# Altium schematic sheet SCH-7-ESC5.SchDoc
size Letter
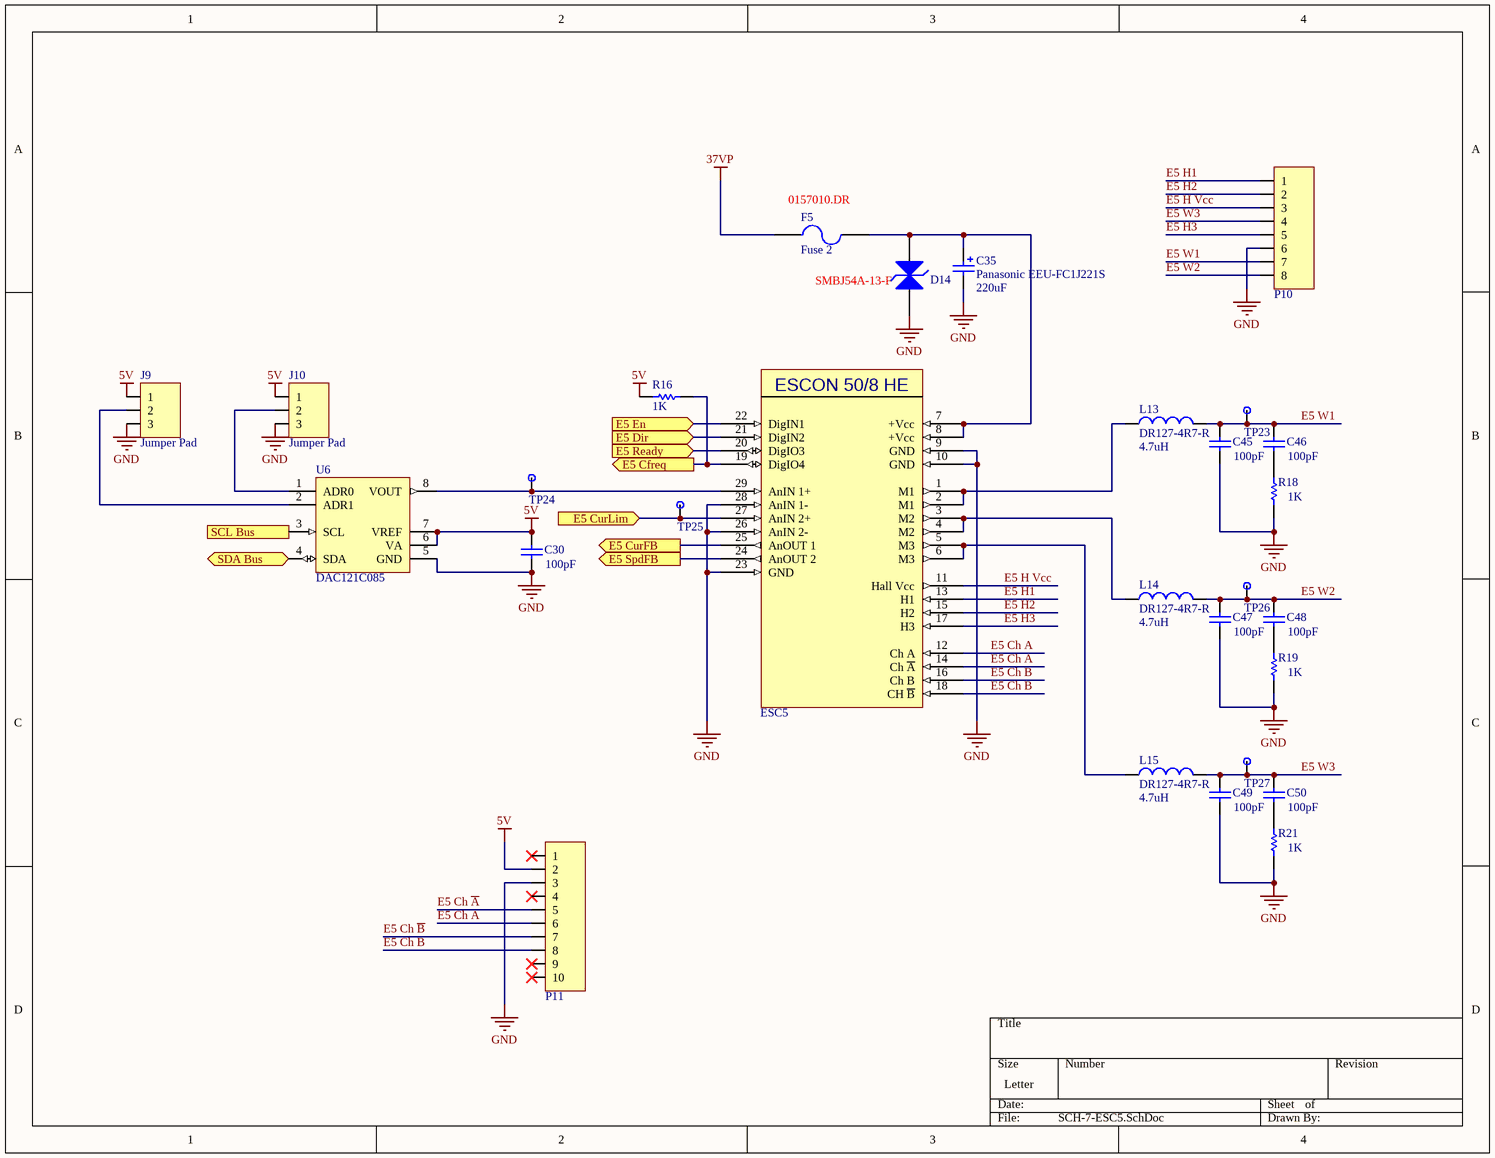
[diagram p0: SCH-7-ESC5.SchDoc]

## Parts
C30  value 100pF  [C1206]  (hidden comment: Cap Semi)
C35  Panasonic EEU-FC1J221S  value 220uF  [Panasonic EEU-FC1J221S]
C45  value 100pF  [C1206]  (hidden comment: Cap Semi)
C46  value 100pF  [C1206]  (hidden comment: Cap Semi)
C47  value 100pF  [C1206]  (hidden comment: Cap Semi)
C48  value 100pF  [C1206]  (hidden comment: Cap Semi)
C49  value 100pF  [C1206]  (hidden comment: Cap Semi)
C50  value 100pF  [C1206]  (hidden comment: Cap Semi)
D14  TVS_DIODE  [SMBJ54A-13-F]  (value not drawn)
ESC5  ESCON 50/8 HE  [ESCON 50/8 HE]  (value not drawn)
F5  Fuse 2  [0157010.DR]
J9  Jumper Pad  [3 Pad TH]
J10  Jumper Pad  [3 Pad TH]
L13  DR127-4R7-R  value 4.7uH  [DR127-4R7-R]
L14  DR127-4R7-R  value 4.7uH  [DR127-4R7-R]
L15  DR127-4R7-R  value 4.7uH  [DR127-4R7-R]
P10  Mini-Fit Jr 8 Pos  [Molex Mini-Fit Jr 0039281083]  (value not drawn)
P11  Header_10_Pos_Ribbon Male  [3M_2510-6002UB]  (value not drawn)
R16  value 1K  [RESC1608X06N_0603]  (hidden comment: Res1)
R18  value 1K  [RESC1608X06N_0603]  (hidden comment: Res1)
R19  value 1K  [RESC1608X06N_0603]  (hidden comment: Res1)
R21  value 1K  [RESC1608X06N_0603]  (hidden comment: Res1)
TP23  TestPt  [50_MIL_PAD]  (value not drawn)
TP24  TestPt  [50_MIL_PAD]  (value not drawn)
TP25  TestPt  [50_MIL_PAD]  (value not drawn)
TP26  TestPt  [50_MIL_PAD]  (value not drawn)
TP27  TestPt  [50_MIL_PAD]  (value not drawn)
U6  DAC121C085  [MUA08A_L]

## Ports
E5 Cfreq (out), E5 CurFB (out), E5 CurLim (in), E5 Dir (in), E5 En (in), E5 Ready (in), E5 SpdFB (out), SCL Bus (in), SDA Bus (bidir)

## Nets
5V: C30.2 J9.1 J10.1 P11.2 R16.2 U6.6(VA) U6.7(VREF)
37VP: F5.1
GND: C30.1 C35.2 C45.1 C47.1 C49.1 D14.1(A) ESC5.9(GND) ESC5.10(GND) ESC5.23(GND) ESC5.26(AnIN_2-) ESC5.28(AnIN_1-) J9.3 J10.3 P10.6 P11.3 R18.1 R19.1 R21.1 U6.5(GND)
E5 Cfreq: ESC5.19(DigIO4) R16.1 ; port E5 Cfreq
E5 Ch A: ESC5.12(Ch_A) P11.6
E5 Ch ~{A}: ESC5.14(Ch_~{A}) P11.5
E5 Ch B: ESC5.16(Ch_B) P11.8
E5 Ch ~{B}: ESC5.18(CH_~{B}) P11.7
E5 CurFB: ESC5.25(AnOUT_1) ; port E5 CurFB
E5 CurLim: ESC5.27(AnIN_2+) TP25.1 ; port E5 CurLim
E5 Dir: ESC5.21(DigIN2) ; port E5 Dir
E5 En: ESC5.22(DigIN1) ; port E5 En
E5 H1: ESC5.13(H1) P10.1
E5 H2: ESC5.15(H2) P10.2
E5 H3: ESC5.17(H3) P10.5
E5 H Vcc: ESC5.11(Hall_Vcc) P10.3
E5 Ready: ESC5.20(DigIO3) ; port E5 Ready
E5 SpdFB: ESC5.24(AnOUT_2) ; port E5 SpdFB
E5 W1: C45.2 C46.2 L13.2 P10.7 TP23.1
E5 W2: C47.2 C48.2 L14.2 P10.8 TP26.1
E5 W3: C49.2 C50.2 L15.2 P10.4 TP27.1
SCL Bus: U6.3(SCL) ; port SCL Bus
SDA Bus: U6.4(SDA) ; port SDA Bus
NetC35_1: C35.1 D14.2(K) ESC5.7(+Vcc) ESC5.8(+Vcc) F5.2
NetC46_1: C46.1 R18.2
NetC48_1: C48.1 R19.2
NetC50_1: C50.1 R21.2
NetESC5_1: ESC5.1(M1) ESC5.2(M1) L13.1
NetESC5_3: ESC5.3(M2) ESC5.4(M2) L14.1
NetESC5_5: ESC5.5(M3) ESC5.6(M3) L15.1
NetESC5_29: ESC5.29(AnIN_1+) TP24.1 U6.8(VOUT)
NetJ9_2: J9.2 U6.2(ADR1)
NetJ10_2: J10.2 U6.1(ADR0)

Not connected (* = marked no-connect by the designer): P11 1* 4* 9* 10*

## Notes on the sheet
- (near F5) 0157010.DR
- (near D14) SMBJ54A-13-F

## Library data of the parts
C30 C45-C50 = Cap Semi: Capacitor (Semiconductor SIM Model); Published: 8-Jun-2000; LatestRevisionDate: 29-May-2009; LatestRevisionNote: IPC-7351 Footprint Added.; PackageReference: C1206; Publisher: Altium Limited; PackageDescription: Chip Capacitor
C35 = Panasonic EEU-FC1J221S: Polarized Capacitor (Radial)
D14 = TVS_DIODE: TVS Diode; Published: 8-Jun-2000; LatestRevisionDate: 17-Jul-2002; LatestRevisionNote: Re-released for DXP Platform.; PackageVersion: Sep-1996; PackageReference: SMC; Publisher: Altium Limited; PackageDescription: DO-214-AB/SMC; 2 C-Bend Leads; Body 7.9 x 5.9 mm, inc. leads (LxW); Code_JEDEC: DO-214-AB
ESC5 = ESCON 50/8 HE: ESCON Module 50/8 HE Servocontroller
F5 = Fuse 2: Fuse; Published: 8-Jun-2000; LatestRevisionDate: 17-Jul-2002; LatestRevisionNote: Re-released for DXP Platform.; PackageReference: PIN-W2/E2.8; Publisher: Altium Limited; PackageDescription: Thru-Hole; 2 Leads
J9 J10 = 3 Pad Jump Sel
L13-L15 = DR127-4R7-R: 4.7µH Shielded Wirewound Inductor 8.25A 9.17mOhm Nonstandard; Code_IEC: 1005; Published: 8-Jun-2000; LatestRevisionDate: 29-May-2009; LatestRevisionNote: IPC-7351 Footprint Added.; PackageReference: 0402-A; Publisher: Altium Limited; PackageDescription: Chip Inductor; Code_JEITA: 0402
P10 = Molex Mini-Fit Jr 8pos Vert
P11 = Header_10_Pos_Ribbon Male: 3M_2510-6002UB
R16 R18 R19 R21 = Res1: Resistor; Published: 8-Jun-2000; LatestRevisionDate: 17-Jul-2002; LatestRevisionNote: Re-released for DXP Platform.; PackageReference: AXIAL-0.3; Publisher: Altium Limited; PackageDescription: Axial Device, Thru-Hole; 2 Leads; 0.3 in Pin Spacing
U6 = DAC121C085: 12-Bit Micro Power Digital-to-Analog Converter with an I2C-Compatible Interface and External Reference, 8-pin Mini SOIC, Pb-Free; Manufacturer: National Semiconductor; PackageTopMarking: XTT*X90C; PowerWise: Y; CompType: D/A Converter; ComponentLink3URL: http://www.national.com/packaging/folders/mua08a.html; ComponentLink2URL: http://www.national.com/pf/DA/DAC121C085.html; Code_JEDEC: MO-187-AA; ComponentLink1URL: http://www.national.com/ds/DA/DAC121C085.pdf; RoHS: Y; PackageVersion: revF, Apr-2008; PackageDescription: MINI SOIC, .118 x .118 x .034in, 8 Lead, .0256in Pitch; PackageReference: MUA08A; PinCount: 8; DatasheetVersion: Mar-2008; ComponentLink1Description: DAC121C085 Datasheet; ComponentLink2Description: DAC121C085 Web Page; ComponentLink3Description: MUA08A Package Page; RevisionNote: Component URLs added